# EAGLE schematic minidynalo (EAGLE 7.4.0)
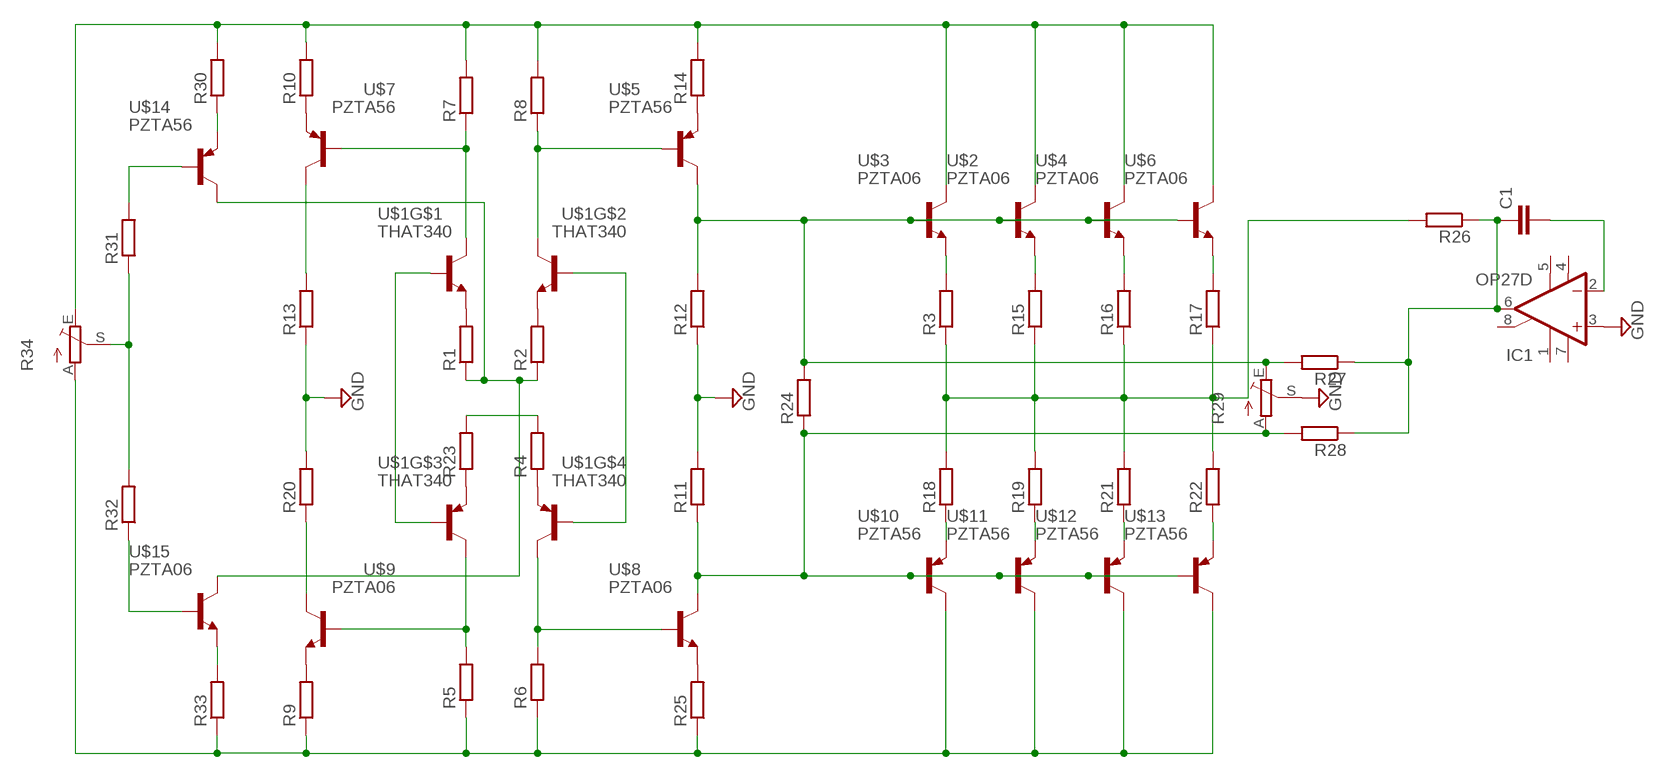
[diagram p0: schematic, sheet 1]

## Parts
C1  C-EUC1206  [C1206]
IC1  OP27D  [SO08]
R1  R-EU_M1206  [M1206]
R2  R-EU_M1206  [M1206]
R3  R-EU_M1206  [M1206]
R4  R-EU_M1206  [M1206]
R5  R-EU_M1206  [M1206]
R6  R-EU_M1206  [M1206]
R7  R-EU_M1206  [M1206]
R8  R-EU_M1206  [M1206]
R9  R-EU_M1206  [M1206]
R10  R-EU_M1206  [M1206]
R11  R-EU_M1206  [M1206]
R12  R-EU_M1206  [M1206]
R13  R-EU_M1206  [M1206]
R14  R-EU_M1206  [M1206]
R15  R-EU_M1206  [M1206]
R16  R-EU_M1206  [M1206]
R17  R-EU_M1206  [M1206]
R18  R-EU_M1206  [M1206]
R19  R-EU_M1206  [M1206]
R20  R-EU_M1206  [M1206]
R21  R-EU_M1206  [M1206]
R22  R-EU_M1206  [M1206]
R23  R-EU_M1206  [M1206]
R24  R-EU_M1206  [M1206]
R25  R-EU_M1206  [M1206]
R26  R-EU_M1206  [M1206]
R27  R-EU_M1206  [M1206]
R28  R-EU_M1206  [M1206]
R29  TRIM_EU-S64W  [S64W]
R30  R-EU_M1206  [M1206]
R31  R-EU_M1206  [M1206]
R32  R-EU_M1206  [M1206]
R33  R-EU_M1206  [M1206]
R34  TRIM_EU-S64W  [S64W]
U$1  THAT340  [DIP254P762X510-14]
U$2  PZTA06  [SOT223R_INFINEON]
U$3  PZTA06  [SOT223R_INFINEON]
U$4  PZTA06  [SOT223R_INFINEON]
U$5  PZTA56  [SOT223R_INFINEON]
U$6  PZTA06  [SOT223R_INFINEON]
U$7  PZTA56  [SOT223R_INFINEON]
U$8  PZTA06  [SOT223R_INFINEON]
U$9  PZTA06  [SOT223R_INFINEON]
U$10  PZTA56  [SOT223R_INFINEON]
U$11  PZTA56  [SOT223R_INFINEON]
U$12  PZTA56  [SOT223R_INFINEON]
U$13  PZTA56  [SOT223R_INFINEON]
U$14  PZTA56  [SOT223R_INFINEON]
U$15  PZTA06  [SOT223R_INFINEON]

## Nets
GND: IC1.3(+IN) R11.2 R12.1 R13.1 R20.2 R29.S
N$1: R1.2 U$1.3(E)
N$2: R2.2 U$1.5(E)
N$3: R23.1 U$1.10(E)
N$4: R4.1 U$1.12(E)
N$5: U$1.2(B) U$1.9(B)
N$6: R5.2 U$1.8(C) U$9.1(B)
N$7: R6.2 U$1.14(C) U$8.1(B)
N$8: R7.1 U$1.1(C) U$7.1(B)
N$9: R8.1 U$1.7(C) U$5.1(B)
N$10: U$1.6(B) U$1.13(B)
N$11: R33.2 U$15.3(E)
N$12: R5.1 R6.1 R9.1 R25.1 R33.1 R34.A U$10.2(C) U$10.4(C) U$11.2(C) U$11.4(C) U$12.2(C) U$12.4(C) U$13.2(C) U$13.4(C)
N$13: R14.1 U$5.3(E)
N$14: R31.2 U$14.1(B)
N$15: R31.1 R32.2 R34.S
N$16: R10.1 U$7.3(E)
N$17: R9.2 U$9.3(E)
N$18: R25.2 U$8.3(E)
N$19: R20.1 U$9.2(C) U$9.4(C)
N$20: R3.1 R15.1 R16.1 R17.1 R18.2 R19.2 R21.2 R22.2 R26.2
N$21: R13.2 U$7.2(C) U$7.4(C)
N$22: R30.1 U$14.3(E)
N$23: R1.1 R2.1 U$14.2(C) U$14.4(C) U$15.2(C) U$15.4(C)
N$24: R11.1 R24.1 R28.2 R29.A U$8.2(C) U$8.4(C) U$10.1(B) U$11.1(B) U$12.1(B) U$13.1(B)
N$25: R4.2 R23.2
N$26: R32.1 U$15.1(B)
N$27: R17.2 U$6.3(E)
N$28: R16.2 U$4.3(E)
N$29: R15.2 U$2.3(E)
N$30: R3.2 U$3.3(E)
N$31: R18.1 U$10.3(E)
N$32: R19.1 U$11.3(E)
N$33: R21.1 U$12.3(E)
N$34: R22.1 U$13.3(E)
N$36: R12.2 R24.2 R27.2 R29.E U$2.1(B) U$3.1(B) U$4.1(B) U$5.2(C) U$5.4(C) U$6.1(B)
N$37: R7.2 R8.2 R10.2 R14.2 R30.2 R34.E U$2.2(C) U$2.4(C) U$3.2(C) U$3.4(C) U$4.2(C) U$4.4(C) U$6.2(C) U$6.4(C)
N$38: C1.1 IC1.6(OUT) R26.1 R27.1 R28.1
N$40: C1.2 IC1.2(-IN)
Unconnected: IC1.1(ON1) IC1.5(OPT) IC1.8(ON2)

## Power pins joined to a net without a drawn wire
V+: IC1.7(V+)
V-: IC1.4(V-)

## Library data of the parts
C1 = Vwvwbg:C-EU: CAPACITOR, European symbol
IC1 = linear:OP27: OP AMP
R1-R28 R30-R33 = Vwvwbg:R-EU_: RESISTOR, European symbol
R29 R34 = pot:TRIM_EU-: POTENTIOMETER
U$1 = transistor-arrays:THAT340
U$2-U$4 U$6 U$8 U$9 U$15 = tranzistory SMD NPN:PZTA06
U$5 U$7 U$10-U$14 = tranzistory SMD PNP:PZTA56